# EAGLE schematic SoilMoisture (EAGLE 7.2.0)
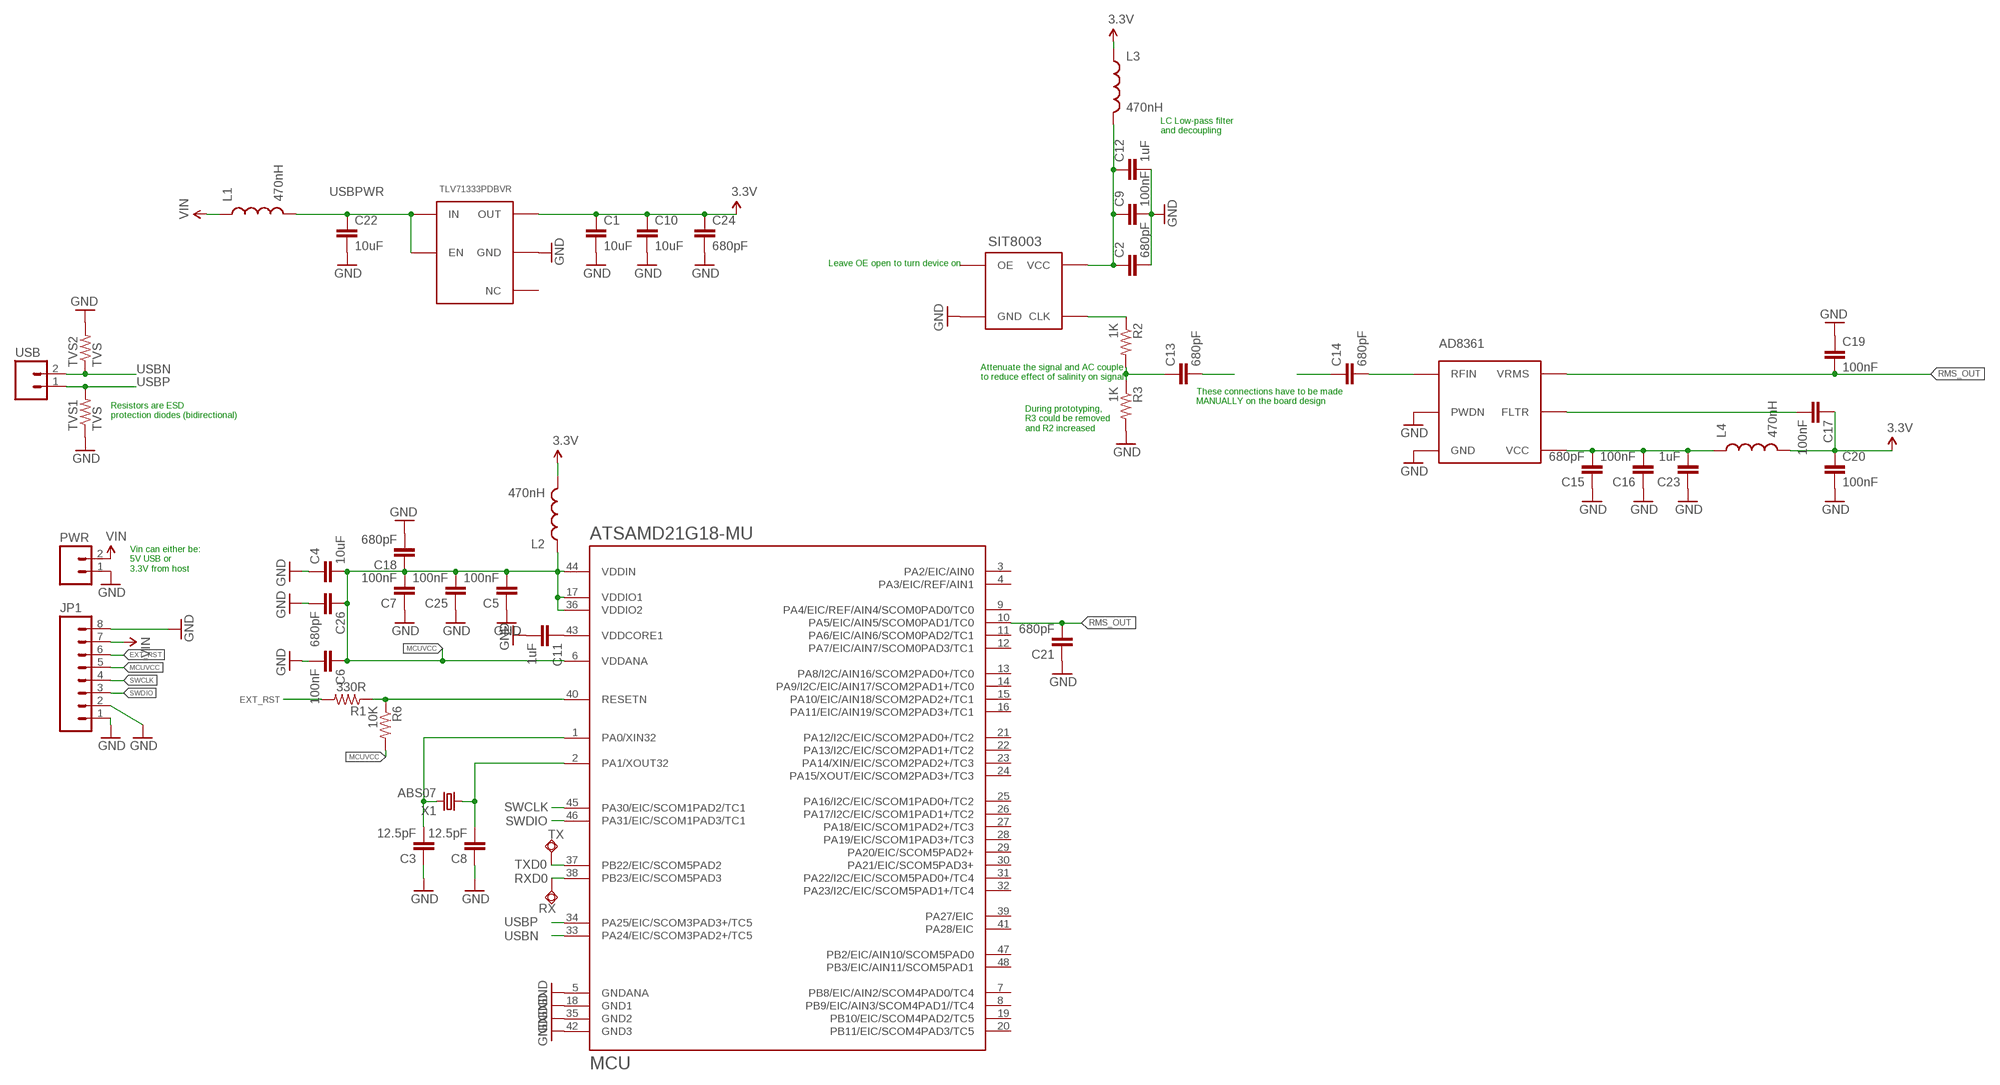
[diagram p0: schematic, sheet 1]

## Parts
AD8361  AD8361  [SOT23-6]
C1  10uF  C_0603  [C0603]
C2  680pF  CAP0402-CAP  [0402-CAP]
C3  12.5pF  CAP0402-CAP  [0402-CAP]
C4  10uF  C_0603  [C0603]
C5  100nF  CAP0402-CAP  [0402-CAP]
C6  100nF  CAP0402-CAP  [0402-CAP]
C7  100nF  CAP0402-CAP  [0402-CAP]
C8  12.5pF  CAP0402-CAP  [0402-CAP]
C9  100nF  CAP0402-CAP  [0402-CAP]
C10  10uF  C_0603  [C0603]
C11  1uF  CAP0402-CAP  [0402-CAP]
C12  1uF  CAP0402-CAP  [0402-CAP]
C13  680pF  CAP0402-CAP  [0402-CAP]
C14  680pF  CAP0402-CAP  [0402-CAP]
C15  680pF  CAP0402-CAP  [0402-CAP]
C16  100nF  CAP0402-CAP  [0402-CAP]
C17  100nF  CAP0402-CAP  [0402-CAP]
C18  680pF  CAP0402-CAP  [0402-CAP]
C19  100nF  CAP0402-CAP  [0402-CAP]
C20  100nF  CAP0402-CAP  [0402-CAP]
C21  680pF  CAP0402-CAP  [0402-CAP]
C22  10uF  C_0603  [C0603]
C23  1uF  CAP0402-CAP  [0402-CAP]
C24  680pF  CAP0402-CAP  [0402-CAP]
C25  100nF  CAP0402-CAP  [0402-CAP]
C26  680pF  CAP0402-CAP  [0402-CAP]
JP1  M08  [1X08_ROUND]
L1  470nH  INDUCTOR0603  [0603]
L2  470nH  INDUCTOR0603  [0603]
L3  470nH  INDUCTOR0603  [0603]
L4  470nH  INDUCTOR0603  [0603]
MCU  ATSAMD21G18-MU  [QFN48]
PWR  M02LOCK_LONGPADS  [1X02_LOCK_LONGPADS]
R1  330R  RESISTOR0402-RES  [0402-RES]
R2  1K  RESISTOR0402-RES  [0402-RES]
R3  1K  RESISTOR0402-RES  [0402-RES]
R6  10K  RESISTOR0402-RES  [0402-RES]
REGULATOR  TLV71333PDBVR  [TLV71333PDBVR]
RX  TPSQTP20SQ  [TP20SQ]
SIT8003  SIT8003  [SIT8003]
TVS1  TVS  RESISTOR0402-RES  [0402-RES]
TVS2  TVS  RESISTOR0402-RES  [0402-RES]
TX  TPSQTP20SQ  [TP20SQ]
USB  M02LOCK_LONGPADS  [1X02_LOCK_LONGPADS]
X1  ABS07  [ABS07]

## Nets
3.3V: C1.1 C10.1 C17.1 C20.1 C24.1 L2.2 L3.1 L4.2 REGULATOR.P$5(OUT)
EXT_RST: JP1.6 R1.2
GND: AD8361.2(GND) AD8361.4(PWDN) C1.2 C2.2 C3.1 C4.1 C5.1 C6.2 C7.1 C8.1 C9.2 C10.2 C11.2 C12.2 C15.1 C16.1 C18.2 C19.1 C20.2 C21.1 C22.2 C23.1 C24.2 C25.1 C26.2 JP1.1 JP1.2 JP1.8 MCU.5(GNDANA) MCU.18(GND1) MCU.35(GND2) MCU.42(GND3) PWR.1 R3.2 REGULATOR.P$2(GND) SIT8003.P$2(GND) TVS1.1 TVS2.2
MCUVCC: C4.2 C5.2 C6.1 C7.2 C18.1 C25.2 C26.1 JP1.5 L2.1 MCU.6(VDDANA) MCU.17(VDDIO1) MCU.36(VDDIO2) MCU.44(VDDIN) R6.2
N$1: C2.1 C9.1 C12.1 L3.2 SIT8003.P$4(VCC)
N$2: MCU.40(RESETN) R1.1 R6.1
N$3: C3.2 MCU.1(PA0/XIN32) X1.P$2
N$4: C11.1 MCU.43(VDDCORE1)
N$5: C8.2 MCU.2(PA1/XOUT32) X1.P$1
N$6: R2.1 SIT8003.P$3(CLK)
N$7: C13.1 R2.2 R3.1
N$8: C13.2
N$9: C14.1
N$10: AD8361.5(RFIN) C14.2
N$11: AD8361.3(FLTR) C17.2
N$12: AD8361.6(VCC) C15.2 C16.2 C23.2 L4.1
RMS_OUT: AD8361.1(VRMS) C19.2 C21.2 MCU.10(PA5/EIC/AIN5/SCOM0PAD1/TC0)
RXD0: MCU.38(PB23/EIC/SCOM5PAD3) RX.TP
SWCLK: JP1.4 MCU.45(PA30/EIC/SCOM1PAD2/TC1)
SWDIO: JP1.3 MCU.46(PA31/EIC/SCOM1PAD3/TC1)
TXD0: MCU.37(PB22/EIC/SCOM5PAD2) TX.TP
USBN: MCU.33(PA24/EIC/SCOM3PAD2+/TC5) TVS2.1 USB.2
USBP: MCU.34(PA25/EIC/SCOM3PAD3+/TC5) TVS1.2 USB.1
USBPWR: C22.1 L1.2 REGULATOR.P$1(IN) REGULATOR.P$3(EN)
VIN: JP1.7 L1.1 PWR.2
Unconnected: MCU.3(PA2/EIC/AIN0) MCU.4(PA3/EIC/REF/AIN1) MCU.7(PB8/EIC/AIN2/SCOM4PAD0/TC4) MCU.8(PB9/EIC/AIN3/SCOM4PAD1//TC4) MCU.9(PA4/EIC/REF/AIN4/SCOM0PAD0/TC0) MCU.11(PA6/EIC/AIN6/SCOM0PAD2/TC1) MCU.12(PA7/EIC/AIN7/SCOM0PAD3/TC1) MCU.13(PA8/I2C/AIN16/SCOM2PAD0+/TC0) MCU.14(PA9/I2C/EIC/AIN17/SCOM2PAD1+/TC0) MCU.15(PA10/EIC/AIN18/SCOM2PAD2+/TC1) MCU.16(PA11/EIC/AIN19/SCOM2PAD3+/TC1) MCU.19(PB10/EIC/SCOM4PAD2/TC5) MCU.20(PB11/EIC/SCOM4PAD3/TC5) MCU.21(PA12/I2C/EIC/SCOM2PAD0+/TC2) MCU.22(PA13/I2C/EIC/SCOM2PAD1+/TC2) MCU.23(PA14/XIN/EIC/SCOM2PAD2+/TC3) MCU.24(PA15/XOUT/EIC/SCOM2PAD3+/TC3) MCU.25(PA16/I2C/EIC/SCOM1PAD0+/TC2) MCU.26(PA17/I2C/EIC/SCOM1PAD1+/TC2) MCU.27(PA18/EIC/SCOM1PAD2+/TC3) MCU.28(PA19/EIC/SCOM1PAD3+/TC3) MCU.29(PA20/EIC/SCOM5PAD2+) MCU.30(PA21/EIC/SCOM5PAD3+) MCU.31(PA22/I2C/EIC/SCOM5PAD0+/TC4) MCU.32(PA23/I2C/EIC/SCOM5PAD1+/TC4) MCU.39(PA27/EIC) MCU.41(PA28/EIC) MCU.47(PB2/EIC/AIN10/SCOM5PAD0) MCU.48(PB3/EIC/AIN11/SCOM5PAD1) REGULATOR.P$4(NC) SIT8003.P$1(OE)

## Notes on the sheet
- LC Low-pass filter
  and decoupling
- Leave OE open to turn device on
- Attenuate the signal and AC couple
  to reduce effect of salinity on signal
- These connections have to be made 
  MANUALLY on the board design
- Resistors are ESD
  protection diodes (bidirectional)
- During prototyping,
  R3 could be removed
  and R2 increased
- Vin can either be:
  5V USB or
  3.3V from host

## Library data of the parts
AD8361 = m2m4all:AD8361
C1 C4 C10 C22 = gknff:C
C2 C3 C5-C9 C11-C21 C23-C26 = SparkFun-Passives:CAP: Capacitor Standard 0603 ceramic capacitor, and 0.1" leaded capacitor.
JP1 = SparkFun-Connectors:M08: Header 8 Standard 8-pin 0.1" header. Use with straight break away headers (SKU : PRT-00116), right angle break away headers (PRT-00553), swiss pins (PRT-00743), machine pins (PRT-00117), and female headers (PRT-00115).; PROD_ID: CONN-08437
L1-L4 = SparkFun-Passives:INDUCTOR: Inductors Basic Inductor/Choke - 0603 and 1206. Footprints are not proven and vary greatly between part numbers. INDUCTOR POWER 3.3UH 4.0A SMD 0.197" L x 0.197" W x 0.177" H (5.00mm x 5.00mm x 4.50mm)
MCU = gknff:ATSAMD21G18
PWR USB = SparkFun-Connectors:M02: Standard 2-pin 0.1" header. Use with - straight break away headers ( PRT-00116) - right angle break away headers (PRT-00553) - swiss pins (PRT-00743) - machine pins (PRT-00117) - female headers (PRT-00115) Molex polarized connector foot print use with: PRT-08233 with associated crimp pins and housings. 2.54_SCREWTERM for use with PRT-10571. 3.5mm Screw Terminal footprints for PRT-08084 5mm Screw Terminal footprints for use with PRT-08432
R1-R3 R6 TVS1 TVS2 = SparkFun-Passives:RESISTOR: Resistor Basic schematic elements and footprints for 0603, 1206, and PTH resistors.
REGULATOR = m2m4all:TLV71333PDBVR
RX TX = testpad:TPSQ: Test pad
SIT8003 = nickleijenhorst:SIT8003
X1 = m2m4all:ABS07